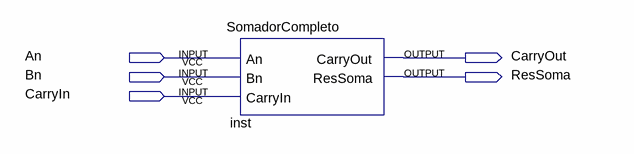
[diagram p0: schematic sheet]
// Quartus schematic SomaCompleto.bdf as structural Verilog: 1 symbols, 5 pins
module SomaCompleto (
  input  An,
  input  Bn,
  input  CarryIn,
  output CarryOut,
  output ResSoma
);

  SomadorCompleto inst (.An(An), .Bn(Bn), .CarryIn(CarryIn), .CarryOut(CarryOut), .ResSoma(ResSoma));
endmodule
